# EAGLE board InkTime (EAGLE 9.7.0)
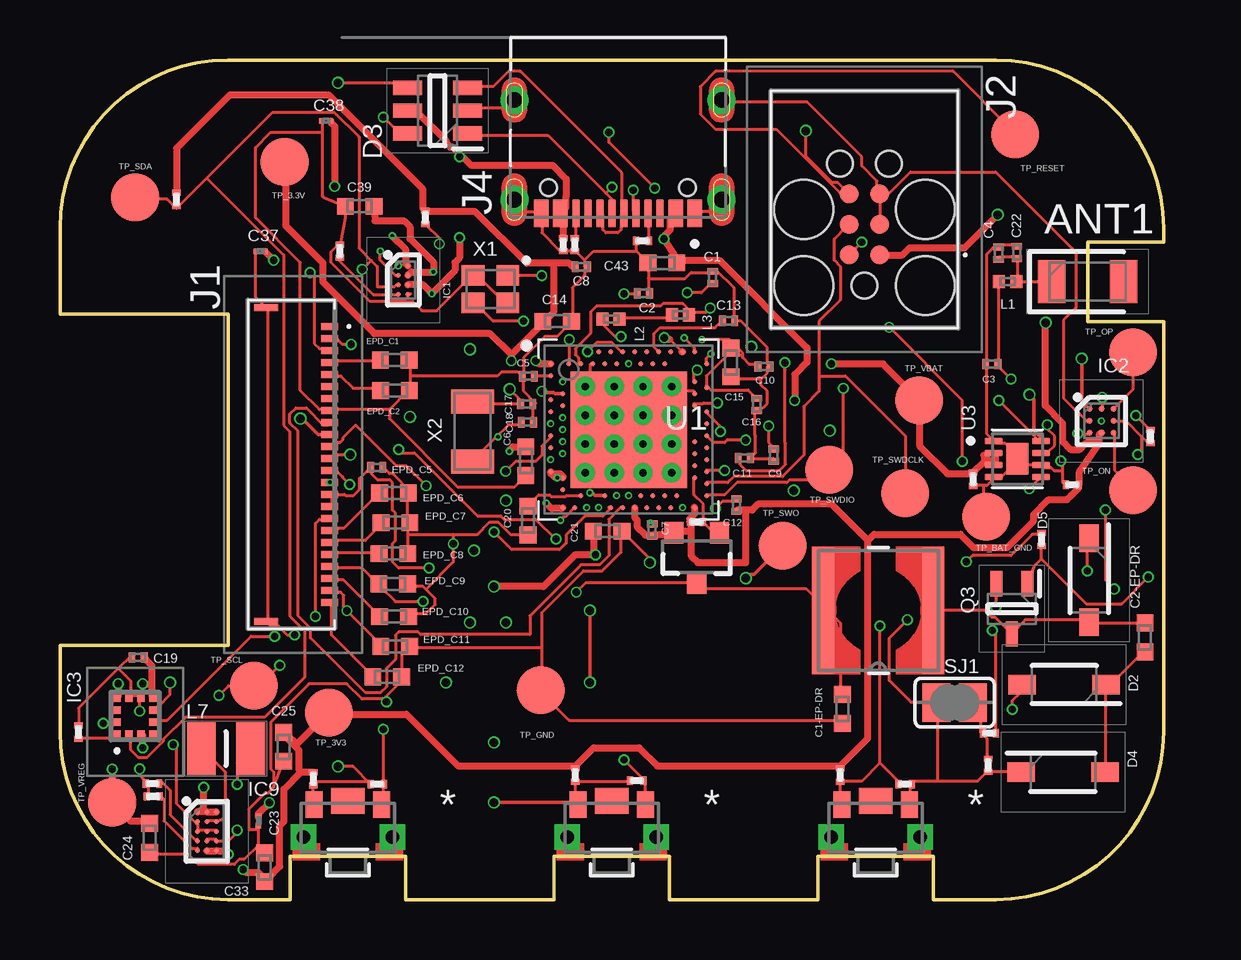
[diagram p2: board, top side]
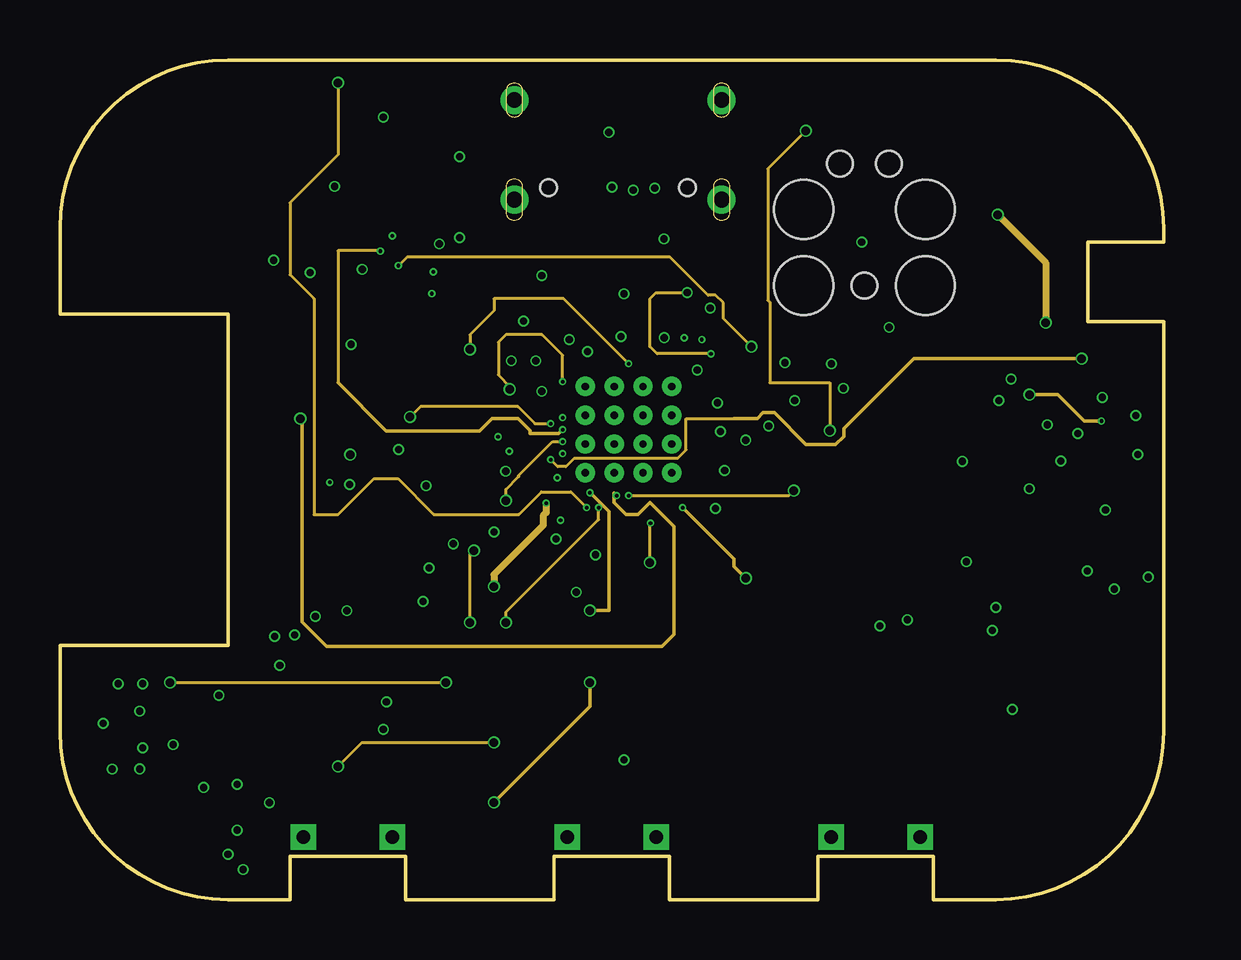
[diagram p3: board, inner layer Route2]
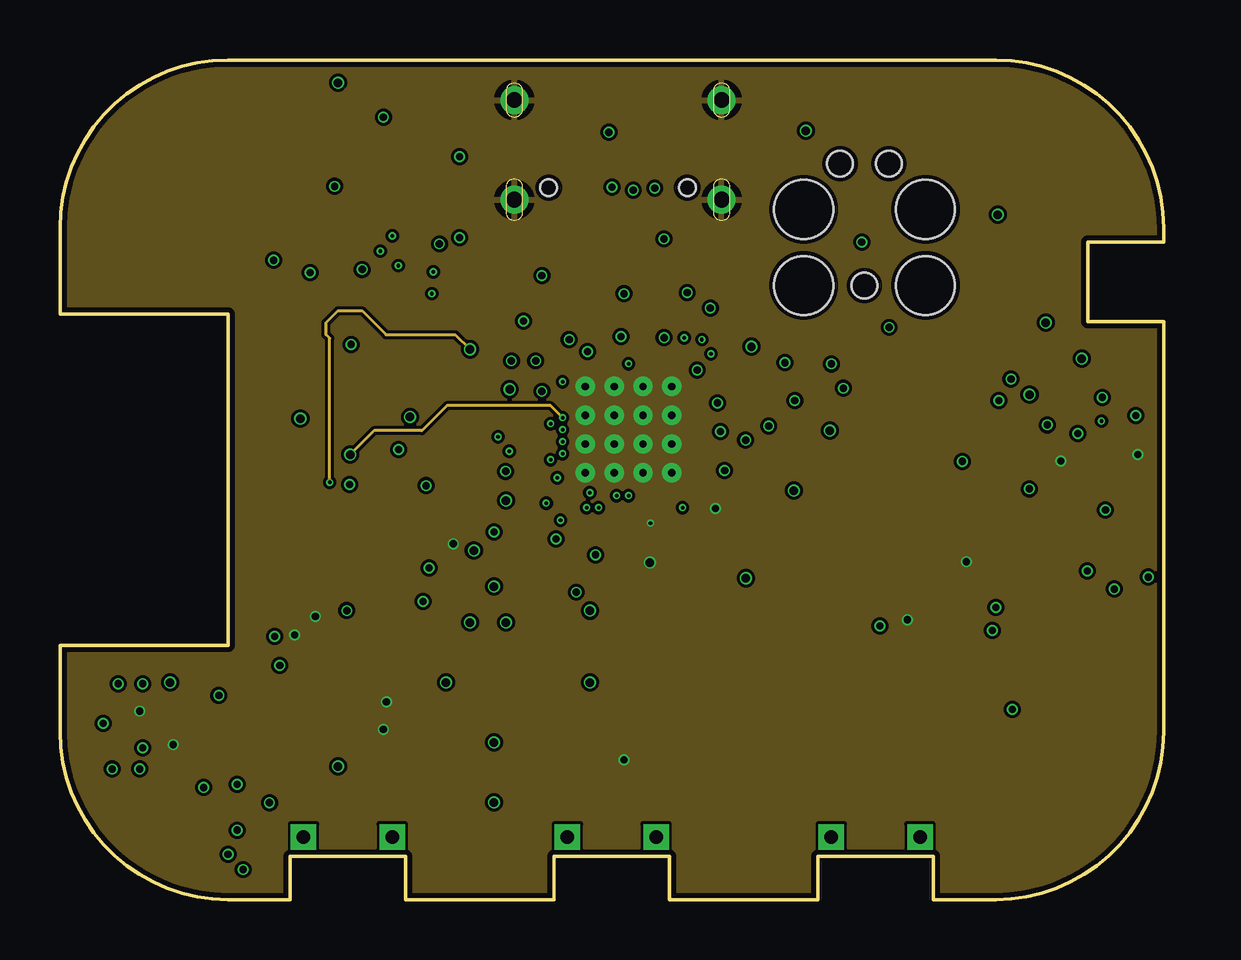
[diagram p4: board, inner layer Route15]
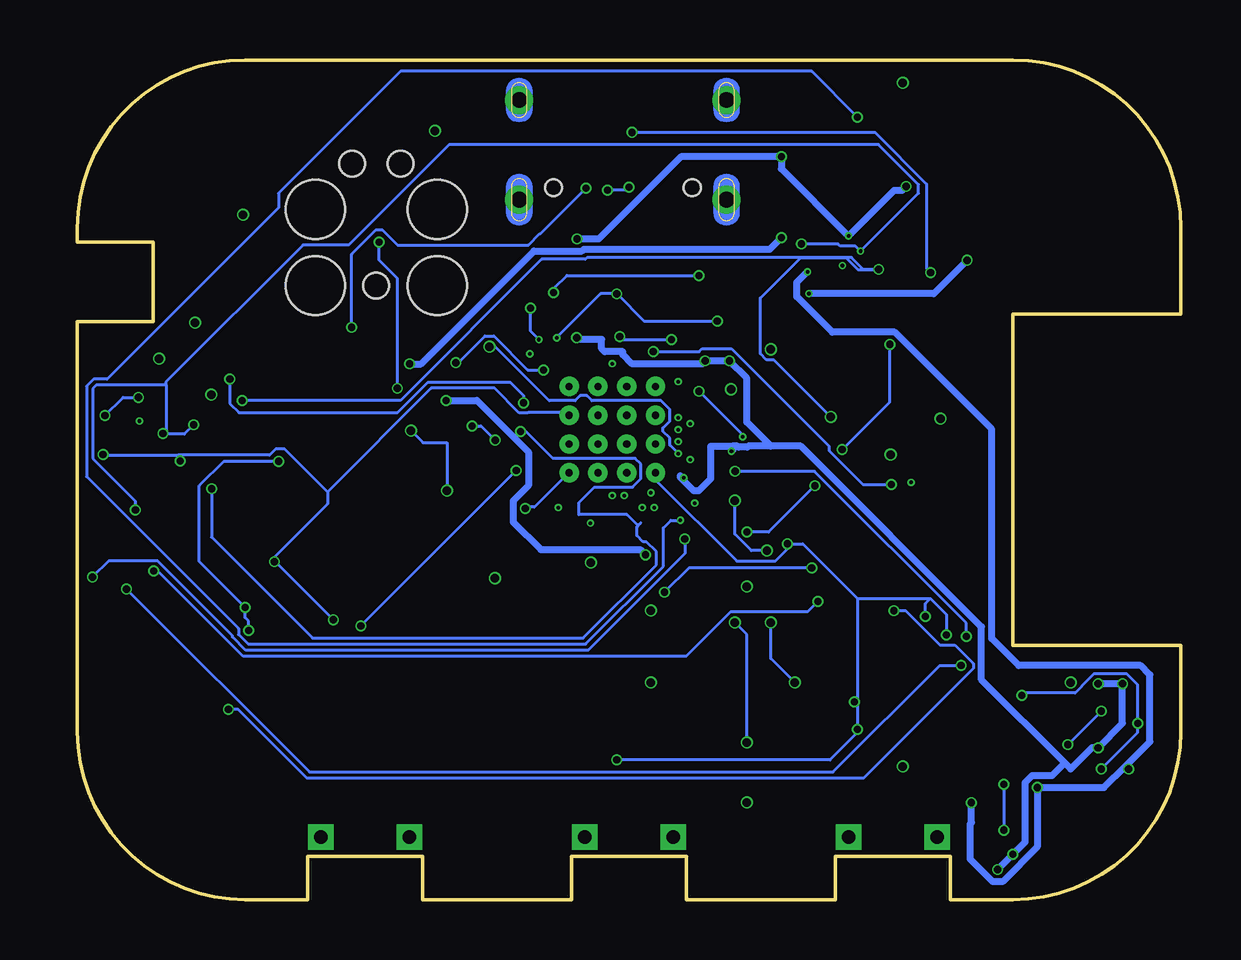
[diagram p5: board, bottom side, seen from below]

Size 46 x 35 mm. Coordinates in mm from the lower left corner, seen from the top.
Outline: 39,0 36.4,0 36.4,1.8 31.6,1.8 31.6,0 25.4,0 25.4,1.8 20.6,1.8 20.6,0 14.4,0 14.4,1.8 9.6,1.8 9.6,0 7,0 arc-90 0,7 0,10.6 7,10.6 7,24.4 0,24.4 0,28 arc-90 7,35 39,35 arc-90 46,28 46,27.42 42.84,27.42 42.84,24.09 46,24.09 46,7 arc-90 39,0
Copper layers (1+2*15+16): Top 0.035mm / dielectric 1.6mm / Route2 0.035mm / dielectric 0.15mm / Route15 0.035mm / dielectric 0.2mm / Bottom 0.035mm
Design rules "jlcpcb-2layers.dru *": minimum track width 5mil, minimum drill 0.3mm, track to track 5mil, track to pad 5mil, pad to pad 5mil, via to via 5mil, smd to smd 5mil, copper to edge 0.2mm, drill to drill 6mil, minimum pad ring 10mil, minimum via ring 3mil, stop-mask expansion 4mil, vias tented up to drill 0mil, thermal gap 10mil

## Footprints (pad centres in the part's own frame; a part is rotated, then mirrored left to right if it is on the bottom)
2450AT18B100E_ANTC3216X140N = smd 1.15 x 1.8: 1 -1.5,0; 2 1.5,0
NORDIC_NRF_3_RESC0201_L = smd 0.28 x 0.43: 1 -0.255,0; 2 0.255,0
NORDIC_NRF_3_RESC0402_M = smd 0.7 x 0.7: 1 -0.6,0; 2 0.6,0
GRM011R60J152KE01L_2_CAPC0201X13N = smd 0.22 x 0.23: 1 -0.185,0; 2 0.185,0
GRM011R60J152KE01L_1_0201 = smd 0.35 x 0.25: 1 0,0.275; 2 0,-0.275
ESP32_C6_LIBRARY_5_SOD3716X135N = smd 1.15 x 0.8: 1 -1.75,0; 2 1.75,0
ESP32_C6_LIBRARY_3_SOT95P280X145-6N = smd 1.2 x 0.6: 1 -1.25,0.95; 2 -1.25,0; 3 -1.25,-0.95; 4 1.25,-0.95; 5 1.25,0; 6 1.25,0.95
ESP32_C6_LIBRARY_4_ESP32_C6_LIBRARY_4_ESP32_C6_LIBRARY_4_ESP32_C6_LIBRARY_4_ESP32_WROVER_SPARKFUN-DISCRETESEMI_SOT23-3 = smd 0.8 x 0.9: 1 -0.95,-1; 2 0.95,-1; 3 0,1.1
BQ25180YBGR_BGA8C40P2X4_100X155X50 = smd 0.2 x 0.2: A1 -0.2,0.6; A2 0.2,0.6; B1 -0.2,0.2; B2 0.2,0.2; C1 -0.2,-0.2; C2 0.2,-0.2; D1 -0.2,-0.6; D2 0.2,-0.6
DRV2605YZFR_BGA9C50P3X3_144X144X62 = smd 0.25 x 0.25: A1 -0.5,0.5; A2 0,0.5; A3 0.5,0.5; B1 -0.5,0; B2 0,0; B3 0.5,0; C1 -0.5,-0.5; C2 0,-0.5; C3 0.5,-0.5
BMA423_BMA423 = smd 0.3 x 0.35: 1 -0.75,-0.775; 2 -0.25,-0.775; 3 0.25,-0.775; 4 0.75,-0.775; 7 0.75,0.775; 8 0.25,0.775; 9 -0.25,0.775; 10 -0.75,0.775 | smd 0.35 x 0.3: 5 0.775,-0.25; 6 0.775,0.25; 11 -0.775,0.25; 12 -0.775,-0.25
RT6160AWSC_BGA15C40P3X5_140X230X60 = smd 0.216 x 0.216: A1 -0.4,0.8; A2 0,0.8; A3 0.4,0.8; B1 -0.4,0.4; B2 0,0.4; B3 0.4,0.4; C1 -0.4,0; C2 0,0; C3 0.4,0; D1 -0.4,-0.4; D2 0,-0.4; D3 0.4,-0.4; E1 -0.4,-0.8; E2 0,-0.8; E3 0.4,-0.8
503480-2400_5034802400 = smd 0.3 x 0.7: 1 -5.75,1.525; 2 -5.25,1.525; 3 -4.75,1.525; 4 -4.25,1.525; 5 -3.75,1.525; 6 -3.25,1.525; 7 -2.75,1.525; 8 -2.25,1.525; 9 -1.75,1.525; 10 -1.25,1.525; 11 -0.75,1.525; 12 -0.25,1.525; 13 0.25,1.525; 14 0.75,1.525; 15 1.25,1.525; 16 1.75,1.525; 17 2.25,1.525; 18 2.75,1.525; 19 3.25,1.525; 20 3.75,1.525; 21 4.25,1.525; 22 4.75,1.525; 23 5.25,1.525; 24 5.75,1.525 | smd 0.3 x 1: MP1 -6.54,-1.125; MP2 6.54,-1.125
TC2030-IDC_TC2030IDC = smd 0.783 x 0.783: 1 -0.953,-0.635; 2 -0.953,0.635; 3 0.317,-0.635; 4 0.317,0.635; 5 1.588,-0.635; 6 1.588,0.635 | hole 2.451: -2.223,-2.54; -2.223,2.54; 0.952,-2.54; 0.952,2.54 | hole 1.067: -2.223,0; 2.857,-1.016; 2.857,1.016
KH-TYPE-C-16P_KINGHELM_KH-TYPE-C-16P = smd 0.6 x 1.15: A1_B12 -3.2,4.725; A4_B9 -2.4,4.725; A9_B4 2.4,4.725; A12_B1 3.2,4.725 | smd 0.3 x 1.15: A5 -1.25,4.725; A6 -0.25,4.725; A7 0.25,4.725; A8 1.25,4.725; B5 1.75,4.725; B6 0.75,4.725; B7 -0.75,4.725; B8 -1.75,4.725 | drill 0.65 pad 1.05: SH1 -4.32,0; SH2 4.32,0; SH3 -4.32,4.15; SH4 4.32,4.15 | hole 0.7: -2.89,3.65; 2.89,3.65
NORDIC_NRF_2_RESC0201_M = smd 0.5 x 0.55: 1 -0.355,0; 2 0.355,0
ESP32_C6_LIBRARY_2_IND_4828-WE-TPC_WRE = smd 0.9 x 5.3: 1 -2.286,0; 2 2.286,0
MLP2016SR47MT0S1_INDC2016X100N = smd 1.2 x 2.2: 1 -1.028,0; 2 1.028,0
ESP32_C6_LIBRARY_6_SOT65P210X110-3N = smd 1.05 x 0.5: 1 -1.05,0.65; 2 -1.05,-0.65; 3 1.05,0
ERA-1AEB3401C_0201 = smd 0.35 x 0.25: 1 0,0.275; 2 0,-0.275
ESP32_C6_LIBRARY_7_JUMPER_SJ = smd 1.168 x 1.6: 1 -0.762,0; 2 0.762,0
2025-10-22_07-23-44_LIBRARY_SW_EVP-AKE31A_PAN = smd 0.711 x 1.092: 1 -1.4,-0.972; 2 1.4,-0.972 | drill 0.559 pad 0.914 square: 3 -1.848,0.381; 4 1.848,0.381 | smd 1.397 x 1.092: 5 0,-1.124
HECTOR_WATCH_1_TP20R = smd 2 x 2: TP 0,0
NORDIC_NRF_4_AQFN50P700X700X85_HS-74N = smd 4.85 x 4.85: P$74 0,0 | drill 0.3 pad 0.6: P$75 -1.8,1.8; P$76 -0.6,1.8; P$77 0.6,1.8; P$78 1.8,1.8; P$79 -1.8,0.6; P$80 -0.6,0.6; P$81 0.6,0.6; P$82 1.8,0.6; P$83 -1.8,-0.6; P$84 -0.6,-0.6; P$85 0.6,-0.6; P$86 1.8,-0.6; P$87 -1.8,-1.8; P$88 -0.6,-1.8; P$89 0.6,-1.8; P$90 1.8,-1.8 | smd 0.2 x 0.2: P$A8 -1.25,3.25; P$A10 -0.75,3.25; P$A12 -0.25,3.25; P$A14 0.25,3.25; P$A16 0.75,3.25; P$A18 1.25,3.25; P$A20 1.75,3.25; P$A22 2.25,3.25; P$A23 2.75,3.25; P$AA24 3.25,-2.25; P$AB2 -2.75,-2.5; P$AC5 -2,-2.75; P$AC9 -1,-2.75; P$AC11 -0.5,-2.75; P$AC13 0,-2.75; P$AC15 0.5,-2.75; P$AC17 1,-2.75; P$AC19 1.5,-2.75; P$AC21 2,-2.75; P$AC24 3.25,-2.75; P$AD2 -2.75,-3.25; P$AD4 -2.25,-3.25; P$AD6 -1.75,-3.25; P$AD8 -1.25,-3.25; P$AD10 -0.75,-3.25; P$AD12 -0.25,-3.25; P$AD14 0.25,-3.25; P$AD16 0.75,-3.25; P$AD18 1.25,-3.25; P$AD20 1.75,-3.25; P$AD22 2.25,-3.25; P$AD23 2.75,-3.25; P$B1 -3.25,2.75; P$B3 -2.5,2.75; P$B5 -2,2.75; P$B7 -1.5,2.75; P$B9 -1,2.75; P$B11 -0.5,2.75; P$B13 0,2.75; P$B15 0.5,2.75; P$B17 1,2.75; P$B19 1.5,2.75; P$B24 3.25,2.75; P$C1 -3.25,2.25; P$D2 -2.75,2; P$D23 2.75,2; P$E24 3.25,1.75; P$F2 -2.75,1.5; P$F23 2.75,1.5; P$G1 -3.25,1.25; P$H2 -2.75,1; P$H23 2.75,1; P$J1 -3.25,0.75; P$J24 3.25,0.75; P$K2 -2.75,0.5; P$L1 -3.25,0.25; P$L24 3.25,0.25; P$M2 -2.75,0; P$N1 -3.25,-0.25; P$N24 3.25,-0.25; P$P2 -2.75,-0.5; P$P23 2.75,-0.5; P$R1 -3.25,-0.75; P$R24 3.25,-0.75; P$T2 -2.75,-1; P$T23 2.75,-1; P$U1 -3.25,-1.25; P$U24 3.25,-1.25; P$V23 2.75,-1.5; P$W1 -3.25,-1.75; P$W24 3.25,-1.75; P$Y2 -2.75,-2; P$Y23 2.75,-2
ESP32_C6_LIBRARY_SON50P200X200X80-9N = smd 0.76 x 0.27: 1 -0.985,0.75; 2 -0.985,0.25; 3 -0.985,-0.25; 4 -0.985,-0.75; 5 0.985,-0.75; 6 0.985,-0.25; 7 0.985,0.25; 8 0.985,0.75 | smd 0.9 x 1.3: 9 0,0
NORDIC_NRF_BT-XTAL_2016_N = smd 0.95 x 0.85: 1 -0.725,-0.575; 2 0.725,-0.575; 3 0.725,0.575; 4 -0.725,0.575
NORDIC_NRF_1_XTAL_3215_N = smd 1 x 1.8: 1 -1.25,0; 2 1.25,0

## Placement (x,y rotation side)
ANT1  2450AT18B100E  [2450AT18B100E_ANTC3216X140N]  42.83,25.76 0 top
C1  12pF  [NORDIC_NRF_3_RESC0201_L]  27.2,25.93 90 top
C1-EP-DR  10uF  [NORDIC_NRF_3_RESC0402_M]  32.62,7.95 270 top
C2  12pF  [NORDIC_NRF_3_RESC0201_L]  24.32,25.27 0 top
C2-EP-DR  4.7uF/25V  [NORDIC_NRF_3_RESC0402_M]  45.23,10.93 90 top
C3  1pF  [NORDIC_NRF_3_RESC0201_L]  38.84,22.32 180 top
C4  1pF  [NORDIC_NRF_3_RESC0201_L]  39.12,26.95 90 top
C5  100nF  [NORDIC_NRF_3_RESC0201_L]  19.52,21.82 180 top
C6  4.7uF  [NORDIC_NRF_3_RESC0402_M]  19.42,18.27 270 top
C7  100nF  [NORDIC_NRF_3_RESC0201_L]  24.68,15.4 90 top
C8  100nF  [NORDIC_NRF_3_RESC0201_L]  21.73,26.38 0 top
C9  820pF  [NORDIC_NRF_3_RESC0201_L]  29.75,18.53 270 top
C10  N.C  [NORDIC_NRF_3_RESC0201_L]  29.35,22.22 0 top
C11  100pF  [NORDIC_NRF_3_RESC0201_L]  28.53,18.41 0 top
C12  100nF  [NORDIC_NRF_3_RESC0201_L]  28.2,16.44 90 top
C13  N.C.  [NORDIC_NRF_3_RESC0201_L]  27.86,24.12 0 top
C14  4.7uF  [NORDIC_NRF_3_RESC0402_M]  20.72,24.11 0 top
C15  1.0uF  [NORDIC_NRF_3_RESC0402_M]  27.97,22.39 270 top
C16  47nF  [NORDIC_NRF_3_RESC0201_L]  29.04,20.64 270 top
C17  12pF  [NORDIC_NRF_3_RESC0201_L]  19.45,20.66 180 top
C18  12pF  [NORDIC_NRF_3_RESC0201_L]  19.49,19.9 180 top
C19  100nF  [NORDIC_NRF_3_RESC0201_L]  3.25,10.09 180 top
C20  4.7uF  [NORDIC_NRF_3_RESC0402_M]  19.51,15.8 270 top
C21  4.7uF  [NORDIC_NRF_3_RESC0402_M]  22.83,15.36 0 top
C22  N.C  [NORDIC_NRF_3_RESC0201_L]  39.88,26.98 90 top
C23  0.1uF  [GRM011R60J152KE01L_2_CAPC0201X13N]  8.28,3.27 90 top
C24  10uF  [NORDIC_NRF_3_RESC0402_M]  3.74,2.57 90 top
C25  22uF  [NORDIC_NRF_3_RESC0402_M]  9.33,6.37 270 top
C27  0.1uF  [GRM011R60J152KE01L_1_0201]  38.06,17.52 180 top
C29  1uF  [GRM011R60J152KE01L_1_0201]  35.23,4.81 270 top
C30  1uF  [GRM011R60J152KE01L_1_0201]  13.23,4.81 270 top
C31  1uF  [GRM011R60J152KE01L_1_0201]  24.04,4.96 270 top
C32  1uF  [GRM011R60J152KE01L_1_0201]  45.45,19.3 180 top
C33  22uF  [NORDIC_NRF_3_RESC0402_M]  8.54,1.35 90 top
C34  01.uF  [GRM011R60J152KE01L_1_0201]  42.2,17.3 90 top
C37  1uF  [GRM011R60J152KE01L_2_CAPC0201X13N]  8.36,27.02 0 top
C38  1uF  [GRM011R60J152KE01L_2_CAPC0201X13N]  11.1,32.45 0 top
C39  10uF  [NORDIC_NRF_3_RESC0402_M]  12.49,28.9 180 top
C42  0.1uF  [GRM011R60J152KE01L_1_0201]  20.98,27.3 0 top
C43  4.7uF  [NORDIC_NRF_3_RESC0402_M]  25.11,26.54 180 top
D2  MBR0530  [ESP32_C6_LIBRARY_5_SOD3716X135N]  41.86,8.96 180 top
D3  USBLC6-2SC6Y  [ESP32_C6_LIBRARY_3_SOT95P280X145-6N]  15.74,32.89 180 top
D4  MBR0530  [ESP32_C6_LIBRARY_5_SOD3716X135N]  41.81,5.31 0 top
D5  MBR0530  [ESP32_C6_LIBRARY_5_SOD3716X135N]  42.9,13.31 270 top
DMG2305UX-7  20V/4.2A/52mΩ/1.4W  [ESP32_C6_LIBRARY_4_ESP32_C6_LIBRARY_4_ESP32_C6_LIBRARY_4_ESP32_C6_LIBRARY_4_ESP32_WROVER_SPARKFUN-DISCRETESEMI_SOT23-3]  26.54,14.29 180 top
EPD_C1  1uF/50V  [NORDIC_NRF_3_RESC0402_M]  13.96,21.21 180 top
EPD_C2  1uF/50V  [NORDIC_NRF_3_RESC0402_M]  13.95,22.48 180 top
EPD_C5  0.1uF/50V  [NORDIC_NRF_3_RESC0201_L]  13.21,18.02 180 top
EPD_C6  1uF/50V  [NORDIC_NRF_3_RESC0402_M]  13.92,16.95 180 top
EPD_C7  1uF/50V  [NORDIC_NRF_3_RESC0402_M]  13.98,15.71 180 top
EPD_C8  1uF/50V  [NORDIC_NRF_3_RESC0402_M]  13.9,14.42 180 top
EPD_C9  1uF/50V  [NORDIC_NRF_3_RESC0402_M]  13.89,13.16 180 top
EPD_C10  1uF/50V  [NORDIC_NRF_3_RESC0402_M]  13.93,11.79 180 top
EPD_C11  1uF/50V  [NORDIC_NRF_3_RESC0402_M]  13.97,10.55 180 top
EPD_C12  1uF/50V  [NORDIC_NRF_3_RESC0402_M]  13.64,9.28 180 top
IC1  BQ25180YBGR  [BQ25180YBGR_BGA8C40P2X4_100X155X50]  14.31,25.83 0 top
IC2  DRV2605YZFR  [DRV2605YZFR_BGA9C50P3X3_144X144X62]  43.41,19.95 0 top
IC3  BMA421  [BMA423_BMA423]  3.13,7.65 0 top
IC9  RT6160AWSC  [RT6160AWSC_BGA15C40P3X5_140X230X60]  6.12,2.84 0 top
J1  503480-2400  [503480-2400_5034802400]  9.72,18.14 270 top
J2  TC2030-IDC  [TC2030-IDC_TC2030IDC]  33.54,27.82 90 top
J4  KH-TYPE-C-16P  [KH-TYPE-C-16P_KINGHELM_KH-TYPE-C-16P]  23.26,33.33 180 top
L1  3.9nH  [NORDIC_NRF_2_RESC0201_M]  39.5,25.76 0 top
L2  10uH  [NORDIC_NRF_2_RESC0201_M]  22.98,24.2 0 top
L3  15nH  [NORDIC_NRF_2_RESC0201_M]  25.86,24.37 0 top
L5  68uH  [ESP32_C6_LIBRARY_2_IND_4828-WE-TPC_WRE]  34.11,12.05 180 top
L7  FTC252012SR47MBCA  [MLP2016SR47MT0S1_INDC2016X100N]  6.92,6.29 0 top
Q3  SI1308EDL-T1-GE3  [ESP32_C6_LIBRARY_6_SOT65P210X110-3N]  39.68,12.12 270 top
R1_EP_DR  0.47  [ERA-1AEB3401C_0201]  38.74,6.93 90 top
R1_USB  5K1  [ERA-1AEB3401C_0201]  24.28,27.46 90 top
R2  0  [ERA-1AEB3401C_0201]  3.89,4.3 90 top
R2_EP_DR  10K  [ERA-1AEB3401C_0201]  40.92,15.01 0 top
R2_USB  5K1  [ERA-1AEB3401C_0201]  21.45,27.3 0 top
R3  0  [ERA-1AEB3401C_0201]  0.77,6.98 0 top
R4  0  [ERA-1AEB3401C_0201]  3.86,4.83 90 top
R5  10k  [ERA-1AEB3401C_0201]  10.56,5.04 180 top
R7  10k  [ERA-1AEB3401C_0201]  32.52,5.19 180 top
R8  10k  [ERA-1AEB3401C_0201]  21.48,5.19 180 top
R9  10K  [ERA-1AEB3401C_0201]  11.67,27.03 0 top
R17  3K3  [ERA-1AEB3401C_0201]  15.23,28.44 0 top
R18  3K3  [ERA-1AEB3401C_0201]  4.86,29.19 0 top
R_PWR_EPD  10K  [ERA-1AEB3401C_0201]  26.53,15.74 270 top
R_TYPE_SEL  10K  [ERA-1AEB3401C_0201]  38.69,5.59 180 top
SJ1  [ESP32_C6_LIBRARY_7_JUMPER_SJ]  37.3,8.21 0 top
SW_DN  2025-10-22_07-23-44_LIBRARY_EVP-AKE31ASW_EVP-AKE31A_PAN  [2025-10-22_07-23-44_LIBRARY_SW_EVP-AKE31A_PAN]  34,2.99 180 top
SW_ENT  2025-10-22_07-23-44_LIBRARY_EVP-AKE31ASW_EVP-AKE31A_PAN  [2025-10-22_07-23-44_LIBRARY_SW_EVP-AKE31A_PAN]  23,2.99 180 top
SW_UP  2025-10-22_07-23-44_LIBRARY_EVP-AKE31ASW_EVP-AKE31A_PAN  [2025-10-22_07-23-44_LIBRARY_SW_EVP-AKE31A_PAN]  12,2.99 180 top
TP_3.3V  HECTOR_WATCH_1_TPTP20R  [HECTOR_WATCH_1_TP20R]  9.37,30.76 0 top
TP_3V3  HECTOR_WATCH_1_TPTP20R  [HECTOR_WATCH_1_TP20R]  11.21,7.8 0 top
TP_BAT_GND  HECTOR_WATCH_1_TPTP20R  [HECTOR_WATCH_1_TP20R]  38.61,15.95 0 top
TP_GND  HECTOR_WATCH_1_TPTP20R  [HECTOR_WATCH_1_TP20R]  20.04,8.73 0 top
TP_ON  HECTOR_WATCH_1_TPTP20R  [HECTOR_WATCH_1_TP20R]  44.72,17.07 0 top
TP_OP  HECTOR_WATCH_1_TPTP20R  [HECTOR_WATCH_1_TP20R]  44.72,22.82 0 top
TP_RESET  HECTOR_WATCH_1_TPTP20R  [HECTOR_WATCH_1_TP20R]  39.82,31.9 0 top
TP_SCL  HECTOR_WATCH_1_TPTP20R  [HECTOR_WATCH_1_TP20R]  8.09,8.91 0 top
TP_SDA  HECTOR_WATCH_1_TPTP20R  [HECTOR_WATCH_1_TP20R]  3.13,29.27 0 top
TP_SWDCLK  HECTOR_WATCH_1_TPTP20R  [HECTOR_WATCH_1_TP20R]  35.23,16.94 0 top
TP_SWDIO  HECTOR_WATCH_1_TPTP20R  [HECTOR_WATCH_1_TP20R]  32.05,17.92 0 top
TP_SWO  HECTOR_WATCH_1_TPTP20R  [HECTOR_WATCH_1_TP20R]  30.12,14.75 0 top
TP_VBAT  HECTOR_WATCH_1_TPTP20R  [HECTOR_WATCH_1_TP20R]  35.82,20.81 0 top
TP_VREG  HECTOR_WATCH_1_TPTP20R  [HECTOR_WATCH_1_TP20R]  2.18,4.05 0 top
U1  NRF52840_QF  [NORDIC_NRF_4_AQFN50P700X700X85_HS-74N]  23.7,19.59 0 top
U3  MAX17048G+T10  [ESP32_C6_LIBRARY_SON50P200X200X80-9N]  39.91,18.37 0 top
X1  32MHz  [NORDIC_NRF_BT-XTAL_2016_N]  17.94,25.45 180 top
X2  32.768kHz  [NORDIC_NRF_1_XTAL_3215_N]  17.2,19.52 270 top

## Tracks (layer width: path | path; a pad name or v marks a point on that pad's centre or on a via)
3V3  (via drill 0.15, 0.3, 0.35)
  Top 0.127: 25.93,22.84 25.42,23.35
  Top 0.3: 20.59,26.52 21.23,26.52 21.36,26.39 C8.1 | 20.47,17.76 20.85,17.76 20.97,17.63 U1.P$Y2 | v19.83,22.46 19.96,22.33 20.47,22.33 U1.P$B1 | 18.82,22.71 v18.82,22.46 | 18.82,22.71 20.09,23.98 C14.1 20.21,24.11 20.59,24.49 20.59,26.52 | 20.47,17.76 U1.P$W1 | 18.82,22.71 17.93,23.59 13.11,23.59 10.96,25.74 10.96,26.54 9.42,28.08 9.42,30.71 TP_3.3V.TP | 43.33,19.03 43.33,19.41 IC2.C2 | 43.33,19.03 42.47,17.8 C34.2 42.44,17.26 42.44,17.12 42.16,16.85 42.15,16.85 41.97,16.67 41.21,16.67 40.59,16.05 40.59,15.79 39.48,14.68 38.08,14.68 37.54,15.22 33.93,15.22 33.67,14.96 | 34.18,26.9 J2.1 35.12,26.87 35.42,27.17 37.71,27.17 v39.09,28.55 | 3.83,9 3.83,9.76 3.58,10.01 C19.1 | 3.83,9 3.83,8.49 IC3.7 | IC9.E2 6.12,2.01 6.5,2.01 IC9.E3 6.62,2.01 6.88,2.01 v7,1.88 | v3.45,6.33 3.45,6.84 IC3.3 | v2.43,9 2.43,8.49 IC3.10 | v3.45,9 3.83,9 | 26.43,16.36 U1.P$AD23 26.45,16.08 26.25,15.88 R_PWR_EPD.2 26.31,15.73 26.31,15.35 | 26.31,15.35 25.67,15.35 DMG2305UX-7.2 25.55,15.22 24.78,15.22 C7.1 24.64,15.19 24.4,15.19 24.06,15.53 24.06,15.82 23.95,15.93 U1.P$AD14 | 10.05,5.31 R5.2 | 28.59,16.23 28.85,16.23 29.1,16.49 32.15,16.49 33.67,14.96 | 28.59,16.23 28.21,16.23 C12.1 | 33.67,14.96 33.67,6.71 32.53,5.57 R7.2 32.4,5.57 24.9,5.57 24.14,6.33 22.24,6.33 21.48,5.57 R8.2 21.36,5.57 16.6,5.57 14.44,7.73 11.32,7.73 TP_3V3.TP 9.89,6.48 C25.1 9.33,6.86 9.95,6.23 9.95,5.41 10.05,5.31 | C6.1 18.88,18.87 18.73,18.72 v18.73,18.69 | 20.47,17.76 20.63,17.6 20.71,17.6 v20.73,17.58 | 43.33,19.03 42.76,19.03 42.48,18.75 42.14,18.75 41.8,19.08 41.8,19.85 41.07,20.59 41.07,24.03 v41.09,24.05
  Top 0.3: 25.42,23.35 25.26,23.35 v25.18,23.42 | U1.P$A22 25.93,22.84 | 10.05,5.31 9.34,4.6 9.34,3.26 9.16,3.08 9.16,1.38 8.65,0.87 C33.1 8.53,0.87 8.27,1.12 7.77,1.12 v7.64,1.25 | R18.1 4.86,31.32 7.09,33.55 11.19,33.55 15.13,29.61 15.13,28.81 R17.1 15.26,28.68 17.3,28.68 19.46,26.52 20.59,26.52 | 26.31,15.35 26.31,14.33 26.59,14.05 28.59,14.05 28.59,16.23
  Route2 0.3: v39.09,28.55 41.09,26.55 v41.09,24.05
  Bottom 0.3: 18.69,18.9 19.59,18.9 19.59,17.55 20.09,17.05 20.31,17.05 20.84,17.58 | v3.45,9 v2.43,9 2.43,7.34 v3.45,6.33 3.71,6.33 4.6,5.44 4.85,5.69 | 18.69,18.9 18.66,18.87 18.66,18.76 v18.73,18.69 | v25.18,23.42 25.11,23.35 24.15,23.35 24.15,22.97 24.02,22.84 23.26,22.84 23.26,22.71 22.88,22.33 19.96,22.33 v19.83,22.46 v18.82,22.46 18.09,21.73 18.09,19.9 17.09,18.9 | 20.86,17.66 20.86,17.6 20.84,17.58 | 17.09,18.9 15.84,18.9 8.31,11.38 8.31,9.16 4.85,5.69 | 4.85,5.69 5.37,5.17 6.2,5.17 6.49,4.88 6.49,2.4 v7,1.88 v7.64,1.25 | 17.09,18.9 18.04,18.9 18.08,18.86 18.44,18.86 18.48,18.9 18.69,18.9 | 20.84,17.58 v20.73,17.58
ALERT  (via drill 0.3)
  Top 0.127: v40.41,17.12 40.79,17.5 U3.5 | U1.P$J24 26.95,20.29 27.53,19.71 v27.53,19.51
  Bottom 0.127: v40.41,17.12 40.41,15.11 36.2,10.9 24.92,10.9 21.86,13.96 21.86,14.5 22.28,14.91 22.41,14.91 22.67,15.17 22.67,15.54 22.63,15.59 | 22.63,15.59 22.51,15.71 | 22.63,15.59 23.09,16.05 25.09,16.05 25.09,16.55 24.45,17.2 22.85,17.2 22.51,17.54 22.51,18.15 22.75,18.39 26.18,18.39 27.29,19.51 v27.53,19.51
D+  (via drill 0.15, 0.35)
  Top 0.127: v11.59,34.05 14.27,34.05 D3.4
  Route2 0.127: v11.59,34.05 11.59,31.05 9.59,29.05 9.59,26.05 10.59,25.05 10.59,16.05 11.59,16.05 13.09,17.55 14.09,17.55 15.58,16.06 19.14,16.06 20.07,17 21.29,17 U1.P$AD6
  other vias: 21.95,16.34
D-  (via drill 0.15, 0.3)
  Top 0.127: v13.48,32.62 14.12,31.98 14.37,31.98 D3.6 | U1.P$AD4 21.06,15.95 20.98,15.95 20.86,15.83 v20.86,15.81
  Bottom 0.127: v13.48,32.62 15.39,34.52 32.53,34.52 37.61,29.44 37.61,28.84 44.76,21.7 45.32,21.7 45.61,21.4 45.61,17.63 39.28,11.29 39.28,11.05 38.88,10.65 24.81,10.65 21.57,13.89 21.57,15.5 21.26,15.81 v20.86,15.81
DN  (via drill 0.3)
  Top 0.127: 22.75,29.44 20.34,31.86 17.04,31.86 D3.1 | 22.75,29.44 23.01,29.19 23.01,28.68 J4.A7 | v23.89,29.57 23.89,28.68 J4.B7 | 22.75,29.44 v23.01,29.7
  Bottom 0.127: v23.01,29.7 23.14,29.57 v23.89,29.57
DP
  Top 0.127: J4.B6 22.62,28.55 22.62,27.92 22.75,27.79 23.26,27.79 23.39,27.92 23.39,28.55 J4.A6 23.42,28.69 23.42,30.29 19.2,34.52 18.69,34.52 18.05,33.89 17.04,33.89 D3.3
EPD_3V3  (via drill 0.3)
  Top 0.127: J1.16 11.32,16.49 11.32,16.87 J1.15 11.86,16.89 11.9,16.85 12.24,16.85 12.49,17.09 12.49,17.55 EPD_C5.2 12.97,18.01 12.97,17.76 13.23,17.5 13.73,17.5 13.86,17.38 13.86,16.23 13.99,16.11 13.99,14.96 13.86,14.84 13.86,14.08 14.12,13.82 v15.39,13.82 | C1-EP-DR.1 32.53,8.61 32.53,11.54 32.31,11.76 L5.2 31.79,12.28 31.11,12.95 26.78,12.95 DMG2305UX-7.3 21.9,13.19 v21.52,12.81
  Bottom 0.127: v15.39,13.82 20.51,13.82 v21.52,12.81
EPD_BUSY
  Top 0.127: U1.P$AD12 23.39,16.36 22.88,15.85 22.88,14.34 22.5,13.96 21.71,13.96 19.59,11.83 19.59,11.05 15.04,11.05 14.93,11.16 14.12,11.16 13.99,11.03 13.99,10.01 13.61,9.63 13.61,8.87 13.35,8.61 12.73,8.61 10.45,10.9 10.45,11.31 9.93,11.83 9.93,19.52 9.58,19.87 9.58,20.23 9.84,20.49 10.27,20.49 10.97,19.79 11.2,19.79 J1.9
EPD_CS  (via drill 0.15, 0.35)
  Top 0.127: J1.12 11.4,18.55 11.67,18.55 v12.1,18.55
  Route15 0.127: U1.P$K2 20.45,20.59 16.13,20.59 15.09,19.55 13.09,19.55 v12.1,18.56 v12.1,18.55
  other vias: 20.95,20.09
EPD_DC  (via drill 0.3)
  Top 0.127: U1.P$AD10 22.88,16.36 22.88,16.23 22.62,15.98 21.89,15.98 21.1,15.19 21.1,14.86 20.82,14.58 18.82,14.58 v18.09,15.32 | v15.26,17.25 14.43,18.08 14.03,18.08 12.33,19.78 11.78,19.23 11.78,19.16 11.67,19.05 11.4,19.05 J1.11
  Bottom 0.127: v15.26,17.25 17.19,15.32 v18.09,15.32
EPD_RST  (via drill 0.15, 0.35)
  Top 0.152: J1.10 10.75,19.39 10.09,20.05 v10.02,20.05
  Route2 0.152: U1.P$AC11 23.09,16.95 23.09,16.55 23.59,16.05 24.09,16.05 24.59,16.55 25.59,15.55 25.59,11.05 25.09,10.55 11.12,10.55 10.09,11.58 10.09,19.98 v10.02,20.05
  other vias: 23.2,16.84
GDR  (via drill 0.3)
  Top 0.127: 40.91,14.2 40.91,14.71 R2_EP_DR.2 | 40.91,14.2 40.6,13.89 Q3.1 | J1.2 11.32,23.35 11.58,23.35 11.78,23.14 v12.13,23.14 | v20.68,15.03 20.65,15.03 19.82,15.85 18.5,15.85 18.37,15.99 17.41,15.99 14.77,18.62 14.25,18.62 v14.12,18.75 | 40.91,14.2 42.79,12.32 44.25,12.32 v45.37,13.44
  Bottom 0.127: v12.13,23.14 12.13,20.74 v14.12,18.75 | v20.68,15.03 20.68,14.42 24.71,10.39 38.98,10.39 39.53,10.94 39.53,11 42.64,14.11 44.7,14.11 v45.37,13.44
GND  (via drill 0.15, 0.3, 0.35)
  Top 0.127: 2.94,8.49 3.32,8.49 IC3.8 3.32,8.36 v3.32,7.85 | 2.43,9.63 2.94,10.14 C19.2 | 2.43,9.63 0.78,7.98 0.78,7.34 R3.1 | 2.94,8.49 2.94,9.12 2.43,9.63 | 2.94,8.49 IC3.9 | 5.73,3.15 5.73,2.9 | 5.73,2.9 6.12,2.9 | 5.73,2.9 IC9.C1 | 6.12,2.9 6.5,2.9 IC9.C3 | 6.12,2.9 IC9.C2 | 8.27,2.26 8.27,2.9 | 8.27,2.9 8.27,3.03 C23.1 | 8.27,2.26 8.53,2.01 C33.2 8.27,2.26 | 8.27,2.9 7.89,2.9 7.89,3.79 8.56,4.45 8.69,4.45 8.88,4.65 | C24.1 3.83,1.88 5.35,1.88 5.77,1.47 7.27,1.47 7.46,1.67 7.68,1.67 8.27,2.26 | 8.88,4.65 8.91,4.68 8.91,5.31 8.78,5.44 8.78,7.39 10.38,9 11.96,9 12.59,8.36 13.48,8.36 | 8.88,4.65 C25.2 | 5.73,3.15 IC9.B1 | C1-EP-DR.2 32.53,7.47 21.23,7.47 20.09,8.61 TP_GND.TP 20.09,8.74 20.09,10.52 | 20.09,10.52 14.62,10.52 EPD_C11.1 14.5,10.52 14.24,10.27 14.24,9.38 EPD_C12.1 14.12,9.25 14.12,9 13.48,8.36 | 10.94,31.98 10.94,29.32 10.97,29.28 C39.2 11.89,28.4 11.7,27.41 R9.1 11.58,27.28 11.3,27.01 11.3,26.55 12.92,24.94 14.31,24.94 | 10.94,31.98 10.94,32.36 C38.1 | IC1.D2 14.5,25.25 14.62,25.25 14.31,24.94 | X1.4 18.56,24.87 17.29,26.14 X1.2 17.16,26.01 15.7,24.55 15.09,24.55 14.7,24.94 14.31,24.94 | 13.73,20.43 11.32,20.43 J1.8 11.2,20.43 10.81,20.43 10.02,21.23 10.02,26.56 8.15,28.43 8.15,31.35 8.78,31.98 10.94,31.98 | 13.73,20.43 14.5,21.19 EPD_C1.1 14.62,21.32 14.62,21.82 | 13.73,20.43 13.73,20.05 16.58,17.2 18.95,17.2 C6.2 | 14.62,21.82 14.62,22.46 EPD_C2.1 | 29.23,21.7 29.48,21.95 29.48,22.2 C10.2 29.48,22.33 29.48,23.02 28.38,24.12 C13.2 28.09,24.24 28.09,25.51 27.32,26.27 C1.2 27.2,26.14 26.31,26.14 26.05,25.89 24.53,25.89 | 29.23,21.7 28.09,21.7 C15.2 | C9.2 29.74,18.39 28.85,18.39 C11.2 29,18.62 29,19.32 28.97,19.35 28.97,20.3 C16.2 29.1,20.3 29.48,20.68 29.48,21.19 29.23,21.44 29.23,21.7
  Top 0.127: 24.02,27.03 24.02,27.41 R1_USB.1 | 24.02,27.03 24.4,26.65 C43.2 24.53,26.52 24.53,25.89 | 24.53,25.89 24.53,25.38 C2.2 | C18.1 19.7,19.92 19.7,20.55 C17.1 19.83,20.68 19.32,21.19 19.32,21.7 C5.2 | 21.86,26.65 21.86,26.39 C8.2 21.86,26.27 21.86,26.01 21.36,25.51 21.36,24.11 C14.2 21.23,23.98 20.72,23.47 20.21,23.47 19.32,22.59 19.32,21.82 C5.2 | 21.86,26.65 21.48,27.03 R2_USB.2 21.1,27.03 C42.2 20.85,27.03 20.09,27.79 20.09,28.55 J4.A12_B1 19.96,28.68 19.32,28.68 18.94,29.06 J4.SH4 | 24.02,27.03 22.24,27.03 21.86,26.65 | IC2.B1 42.82,19.92 41.82,20.91 41.82,24.15 42.35,24.68 42.35,26.99 39.01,30.33 35.45,30.33 34.56,29.44 34.18,29.44 J2.5 | J2.3 34.18,28.17 34.18,29.32 J2.5 | 41.8,17.89 41.42,17.89 41.29,18.01 40.91,18.01 U3.6 40.79,18.14 40.15,18.14 40.02,18.27 U3.9 | 38.5,17.25 38.63,17.25 38.88,17.5 U3.4 39.01,17.63 39.26,17.63 39.9,18.27 U3.9 | 38.5,17.25 38.12,17.25 C27.1 | 38.5,17.25 38.5,15.98 TP_BAT_GND.TP | C22.2 39.77,27.28 39.14,27.28 C4.2 39.01,27.16 38.88,27.16 38.63,26.9 38.63,22.33 C3.2 38.63,22.2 38.63,19.41 38.88,19.16 U3.1 39.01,19.03 39.39,19.03 39.52,18.9 39.52,18.78 39.9,18.39 U3.9 | C37.1 8.15,27.03 8.15,25.12 8.53,24.74 J1.MP1 8.65,24.62 8.65,11.66 J1.MP2 8.81,11.39 9.12,11.39 9.47,11.03 v9.78,11.03 | 21.99,21.44 22.12,21.57 22.12,22.33 U1.P$B7 | U1.P$F23 26.43,21.19 25.67,21.19 25.55,21.32 U1.P$74 21.99,21.44 | 15.26,12.93 15.64,12.55 15.64,12.3 15.26,11.92 14.62,11.92 EPD_C10.1 | 15.26,12.93 15.13,13.06 14.5,13.06 EPD_C9.1 | EPD_C5.1 13.48,18.01 13.73,17.76 13.86,17.76 14.62,17 EPD_C6.1 14.5,16.87 14.5,15.73 EPD_C7.1 14.5,15.6 14.5,15.22
  Top 0.127: 14.5,15.22 14.5,14.46 EPD_C8.1 | 14.5,15.22 16.39,15.22 | 15.26,12.93 16.39,14.07 v16.39,14.83 16.39,15.22 | SW_DN.1 35.45,4.04 35.45,4.81 C29.1 35.58,4.93 36.59,4.93 | D4.1 40.02,5.31 R_TYPE_SEL.1 38.63,5.31 38.25,4.93 36.59,4.93 | 36.59,4.93 36.59,8.11 SJ1.1 36.47,8.23 35.46,8.23 34.56,9.13 34.56,10.9 v35.33,11.66 | SW_ENT.1 24.4,4.04 24.4,4.93 C31.1 24.28,5.06 v23.51,5.82 | SW_UP.1 13.48,4.04 13.48,4.81 C30.1 13.48,4.83 v13.48,7.09 | IC2.B3 43.96,19.92 44.47,19.92 45.1,19.29 | R2_EP_DR.1 40.91,15.22 40.52,15.22 39.64,14.34 38.04,14.34 v37.78,14.08 | C12.2 28.09,16.62 27.64,16.62 v27.32,16.3 | J1.17 11.2,15.85 10.81,15.85 10.65,15.69 v10.65,11.81 | J4.A1_B12 26.56,28.68 27.2,28.68 27.58,29.06 J4.SH3 | D3.2 17.04,33 18.56,33 18.82,33.25 J4.SH2 | 21.99,21.44 U1.P$75 | C34.1 41.8,17.39 41.8,17.89 | J2.5 34.06,29.44 34.06,29.95 33.42,30.59 33.42,30.97 31.13,33.25 27.7,33.25 J4.SH1 | v13.61,8.23 13.48,8.36 | C20.2 19.49,15.22 18.78,15.22 18.26,15.74 17.92,15.74 17.4,15.22 16.39,15.22 | 14.62,21.82 18.24,21.82 18.41,21.99 19.09,21.99 C5.2 | C32.1 45.36,19.03 45.1,19.29 | v44.93,18.55 45.1,18.71 45.1,19.29 | v24.59,14.05 24.59,14.2 C21.2 23.39,15.35 23.39,14.49 22.6,13.7 21.82,13.7 20.09,11.97 20.09,10.52 | 41.8,17.89 41.8,18.19 v41.72,18.28 | v4.72,6.46 4.85,6.33 4.85,4.01 5.7,3.15 5.73,3.15 | C7.2 24.65,15.66 v24.61,15.69
  Route2 0.127: v24.61,15.69 24.59,15.67 v24.59,14.05
  Bottom 0.127: 35.58,16.99 31.25,21.32 28.61,21.32 27.58,20.29 27.23,20.29 27.22,20.3 25.55,20.3 U1.P$82 | U1.P$90 25.55,17.76 26.94,16.36 27.26,16.36 v27.32,16.3 | 13.48,12.55 10.43,12.55 | 13.48,12.55 15.76,14.83 v16.39,14.83 16.39,14.62 16.91,14.11 18.51,14.11 21.9,17.5 U1.P$87 | 41.8,18.52 37.99,18.52 37.74,18.78 37.36,18.78 35.58,16.99 | 13.48,12.55 13.48,8.23 | 13.48,8.23 v13.48,7.09 13.48,6.96 14.62,5.82 v23.51,5.82 | 37.86,14.2 v35.33,11.66 | 13.48,8.23 v13.61,8.23 | 10.43,12.55 10.65,12.34 v10.65,11.81 | v44.93,18.55 44.9,18.52 41.8,18.52 | v41.72,18.28 41.8,18.36 41.8,18.52 | 37.86,14.2 37.86,14.16 v37.78,14.08 | 35.58,16.99 35.58,16.49 37.86,14.2 | v4.72,6.46 v3.32,7.85 | 10.43,12.55 9.78,11.89 v9.78,11.03
  pour Route15: -3.33,-4.87 51.41,-4.87 50.53,-3.99 50.51,-3.97 50.51,37.52 49.56,38.47 -2.88,38.47 -3.33,38.02
HAPTIC_EN  (via drill 0.15, 0.35)
  Top 0.152: IC2.A1 42.59,20.77 v42.59,22.55
  Route2 0.127: 28.07,20.07 28.09,20.05 26.09,20.05 26.09,18.74 25.75,18.4 21.44,18.4 21.09,18.05 20.74,18.05 U1.P$U1
  Route2 0.152: v42.59,22.55 35.59,22.55 32.67,19.63 32.67,19.31 32.33,18.97 31.1,18.97 29.77,20.3 29.31,20.3 29.07,20.05 28.09,20.05
  other vias: 20.45,18.34
IMU_INT1  (via drill 0.3)
  Top 0.127: U1.P$N1 20.47,19.28 20.09,18.9 20.09,18.52 19.83,18.27 18.99,18.27 v18.58,17.85 | IC3.5 3.96,7.47 4.46,7.47 7.96,10.97 v8.94,10.97
  Bottom 0.127: v8.94,10.97 8.94,11.52 15.27,17.85 v18.58,17.85
IMU_INT2  (via drill 0.15, 0.35)
  Top 0.127: IC3.6 4.06,8.06 4.11,8.06 4.59,8.54 v4.59,9.05
  Route2 0.127: v4.59,9.05 v16.09,9.05 | v17.09,11.55 17.09,14.39 v17.25,14.55 | v18.59,16.63 18.59,17.09 19.12,17.63 19.12,17.68 20.54,19.09 U1.P$P2
  Bottom 0.127: v16.09,9.05 17.09,10.05 v17.09,11.55 | v18.59,16.63 18.59,15.23 17.91,14.55 v17.25,14.55
  other vias: 20.95,19.09
LX1
  Top 0.127: IC9.B2 6.12,3.28 6.5,3.28 IC9.B3 6.88,3.38 6.88,5.31 5.99,6.2 L7.1
LX2  (via drill 0.3)
  Top 0.127: IC9.D2 6.12,2.52 6.5,2.52 IC9.D3 7.02,2.44 7.38,2.81 v7.38,2.89 | v7.38,4.81 7.38,5.69 7.89,6.2 L7.2
  Bottom 0.127: v7.38,4.81 v7.38,2.89
MOSI  (via drill 0.15, 0.35)
  Route2 0.127: U1.P$B13 20.99,25.05 18.09,25.05 18.09,24.55 17.09,23.55 v17.09,22.94
  Route15 0.127: J1.14 11.24,23.4 11.09,23.55 11.09,24.05 11.59,24.55 12.59,24.55 13.59,23.55 16.48,23.55 v17.09,22.94
  other vias: 23.7,22.34 11.24,17.39
N$1  (via drill 0.3)
  Top 0.127: C9.1 29.75,18.85 29.54,19.05 v29.54,19.74 | U1.P$N24 27.24,19.05 27.7,19.05 27.8,19.15 v28.58,19.15
  Bottom 0.127: v29.54,19.74 29.17,19.74 v28.58,19.15
N$2
  Top 0.127: R9.2 11.67,26.61 13.05,25.23 IC1.D1
N$3
  Top 0.127: IC9.D1 5.73,2.52 5.61,2.52 4.59,3.54 4.59,4.55 4.21,4.93 R4.2
N$4  (via drill 0.3)
  Top 0.127: v39.64,21.7 39.14,22.2 C3.1 39.14,22.33 L1.1 | U1.P$H23 26.43,20.68 26.82,20.68 26.84,20.71 v27.41,20.71
  Bottom 0.127: v39.64,21.7 39.64,20.68 39.26,20.3 32.66,20.3 31.39,21.57 27.96,21.57 27.41,21.02 v27.41,20.71
N$5
  Top 0.127: IC9.E1 5.73,2.14 5.48,2.14 4.34,3.28 4.34,4.17 4.21,4.3 R2.2
N$6
  Top 0.127: C4.1 39.14,26.78 39.77,26.78 C22.1 39.9,26.65 39.9,25.76 | 39.9,25.76 ANT1.1 | 39.9,25.76 L1.2
N$7  (via drill 0.15, 0.3)
  Top 0.127: v20.09,26.01 18.69,26.01 X1.1 | C1.1 27.11,25.68 26.73,25.3 v26.15,25.3 | U1.P$B24 26.95,22.56 v27.14,22.75
  Route2 0.127: v27.14,22.75 24.89,22.75 24.59,23.05 24.59,25.05 24.84,25.3 v26.15,25.3
  Bottom 0.127: v20.09,26.01 25.59,26.01 26.15,25.46 v26.15,25.3
N$8  (via drill 0.15, 0.3)
  Top 0.127: v23.51,25.25 24.02,25.25 C2.1 | v19.32,24.11 18.05,24.11 17.29,24.87 X1.3 | U1.P$A23 26.45,22.99 v26.02,23.42
  Bottom 0.127: v19.32,24.11 22.37,24.11 v23.51,25.25 24.19,25.25 v26.02,23.42
N$9  (via drill 0.3)
  Top 0.127: v21.23,23.35 21.23,22.33 U1.P$B3 | v23.39,23.47 23.13,23.47 22.5,24.11 L2.1
  Bottom 0.127: v21.23,23.35 23.26,23.35 v23.39,23.47
N$10  (via drill 0.15, 0.3)
  Top 0.127: 26.94,21.44 26.94,21.82 28.09,22.97 | 26.94,21.44 26.94,21.32 U1.P$E24 | 28.09,22.97 28.47,22.59 | 28.47,22.59 28.72,22.33 28.97,22.33 C10.1 | 28.09,22.97 C15.1 | U1.P$B5 21.61,22.33 21.61,22.59 21.48,22.71 21.48,22.97 22.12,23.6 22.12,24.49 22.37,24.74 25.04,24.74 25.13,24.84 25.96,24.84 26.31,24.49 | 26.31,24.49 L3.2 | 28.47,22.59 28.47,22.78 27.9,23.35 v26.76,23.35 | v27.11,24.65 26.94,24.49 26.31,24.49 | 26.94,21.44 27.14,21.25 28.68,21.25 C16.1
  Bottom 0.127: v27.11,24.65 27.11,23.69 v26.76,23.35
N$11
  Top 0.127: R3.2 2.18,6.71 2.3,6.84 IC3.1
N$12  (via drill 0.3)
  Top 0.127: v26.56,22.08 26.43,21.95 26.43,21.57 U1.P$D23 | C11.1 28.34,18.39 28.34,18.14 28.59,17.89 29.99,17.89 30.25,18.14 30.25,19.03 30.21,19.07 30.21,22.07 30.22,22.08 v30.22,22.38
  Bottom 0.127: v26.56,22.08 27.23,22.08 28.64,23.49 29,23.49 30.12,22.38 v30.22,22.38
N$13
  Top 0.127: L2.2 23.39,24.24 25.29,24.24 25.42,24.36 L3.1
N$14  (via drill 0.15, 0.3)
  Top 0.127: C18.2 19.2,19.79 18.69,19.79 18.09,19.19 | X2.2 17.2,18.3 18.09,19.19 | 18.09,19.19 18.18,19.29 v18.26,19.29
  Top 0.15: U1.P$F2 20.63,21.09 20.57,21.14 20.13,21.14 v20.09,21.19
  Bottom 0.127: v20.09,21.19 18.26,19.36 v18.26,19.29
N$15  (via drill 0.15, 0.35)
  Top 0.127: X2.1 17.29,20.68 19.2,20.68 C17.2 19.2,20.82 v18.75,21.27
  Route2 0.127: U1.P$D2 20.95,22.69 20.09,23.55 18.59,23.55 18.27,23.23 18.27,21.87 18.75,21.39 v18.75,21.27
  other vias: 20.95,21.59
N$16
  Top 0.127: C13.1 27.58,24.11 27.31,23.84 25.01,23.84 24.77,23.59 24.77,23.02 U1.P$A18
N$17
  Top 0.127: U1.P$C1 20.47,21.82 19.83,21.82 C5.1
N$18
  Top 0.127: C2-EP-DR.2 45.1,11.54 42.94,11.54 D5.2 42.82,11.66 40.24,11.66 Q3.3 38.98,11.76 38.83,11.76 38.54,12.05 L5.1
N$20
  Top 0.127: C2-EP-DR.1 45.1,10.27 43.71,8.87 D2.1 43.58,8.87 43.58,5.31 D4.2
N$22
  Top 0.127: R_TYPE_SEL.2 38.63,5.95 38.63,6.71 38.5,6.84 R1_EP_DR.1 38.37,6.96 38.37,7.85 38.12,8.11 SJ1.2
N$23
  Top 0.127: EPD_C1.2 13.35,21.32 12.21,21.32 11.7,21.82 11.32,21.82 J1.5
N$24  (via drill 0.3)
  Top 0.127: v43.45,20.93 43.45,20.55 IC2.A2 | v44.85,20.17 45.36,19.66 C32.2
  Bottom 0.127: v43.45,20.93 44.09,20.93 v44.85,20.17
N$25
  Top 0.127: J1.4 11.32,22.46 13.35,22.46 EPD_C2.2
N$26
  Top 0.127: J1.18 11.32,15.47 11.83,15.47 13.23,16.87 EPD_C6.2
N$27
  Top 0.127: C20.1 19.58,16.49 19.96,16.87 20.41,16.87 20.48,16.8 21.07,16.8 21.11,16.84 U1.P$AC5
N$28
  Top 0.127: J1.19 11.32,14.96 12.72,14.96 13.35,15.6 EPD_C7.2
N$29
  Top 0.127: J1.20 11.32,14.46 13.23,14.46 EPD_C8.2
N$30
  Top 0.127: R2_USB.1 21.48,27.66 21.48,28.55 J4.B5
N$32
  Top 0.127: EPD_C10.2 13.23,11.92 11.83,13.31 11.32,13.31 J1.22
N$34
  Top 0.127: R1_USB.2 24.53,27.54 24.53,28.55 J4.A5
N$35
  Top 0.127: J1.24 11.32,12.3 11.32,11.03 12.97,9.38 EPD_C12.2
OUT+
  Top 0.127: TP_OP.TP 44.72,21.26 IC2.A3
OUT-
  Top 0.127: IC2.C3 43.96,19.41 43.96,17.89 44.72,17.12 TP_ON.TP
P0.13  (via drill 0.15, 0.35)
  Top 0.127: SW_UP.2 10.56,4.04 R5.1 10.56,4.81 10.69,4.93 12.85,4.93 C30.2 12.21,5.55 v11.59,5.55
  Route2 0.127: v11.59,5.55 12.59,6.55 v18.09,6.55 | U1.P$AD8 22.45,15.84 18.59,11.98 v18.59,11.55
  Bottom 0.127: v18.09,6.55 18.09,11.05 v18.59,11.55
  other vias: 22.45,16.34
P0.14  (via drill 0.15, 0.35)
  Top 0.127: SW_ENT.2 21.48,4.04 21.48,4.81 R8.1 21.48,4.93 23.64,4.93 C31.2
  Top 0.152: U1.P$AC9 22.3,16.84 22.18,16.96 v22.09,16.96 | v22.09,9.05 v22.09,12.04 | v18.09,4.05 21.51,4.05 SW_ENT.2
  Route2 0.152: v22.09,16.96 22.88,16.17 22.88,12.04 v22.09,12.04 | v22.09,9.05 22.09,8.05 v18.09,4.05
P1.01
  Top 0.127: U1.P$Y23 26.43,17.5 26.43,16.87 26.82,16.49 26.82,15.85 R_PWR_EPD.1 26.82,15.73 27.2,15.35 27.45,15.35 DMG2305UX-7.1
P1.02  (via drill 0.3)
  Top 0.127: SW_DN.2 32.53,4.04 32.53,4.81 R7.1 32.53,4.93 33.42,4.93 34.18,5.69 | v27.7,17.89 26.94,17.89 U1.P$W24 | 34.18,5.69 v34.18,11.41 | 34.18,5.69 34.94,4.93 C29.2
  Bottom 0.127: v34.18,11.41 v27.7,17.89
PMIC_INT  (via drill 0.15, 0.35)
  Route2 0.127: v28.82,23.05 27.65,24.22 27.65,24.88 27.33,25.2 27.02,25.2 25.42,26.79 14.47,26.79 IC1.A1
  Bottom 0.127: U1.P$T2 21.3,18.95 21.3,19.24 21.59,19.52 21.59,19.66 21.3,19.94 21.3,20.44 21.66,20.8 24.55,20.8 24.75,21 25.04,21 25.25,20.8 26.34,20.8 28.59,23.05 v28.82,23.05
  other vias: 20.95,18.59 14.11,26.43
PREVGH  (via drill 0.3)
  Top 0.127: J1.21 11.32,13.82 12.59,13.82 13.23,13.19 EPD_C9.2 13.35,13.06 13.99,12.43 v15.13,12.43 | v42.82,13.7 42.82,14.96 D5.1
  Bottom 0.127: v15.13,12.43 15.57,11.99 18.77,11.99 20.63,10.14 39.09,10.14 42.64,13.7 v42.82,13.7
PREVGL  (via drill 0.3)
  Top 0.127: EPD_C11.2 13.35,10.65 v11.96,12.04 11.83,12.17 11.83,12.68 11.7,12.81 11.32,12.81 J1.23 | D2.2 40.02,8.87 40.02,8.61 39.7,8.29 v39.7,7.92
  Bottom 0.127: v11.96,12.04 11.47,12.04 10.04,10.61 9.43,10.61 8.65,9.84 8.65,9.63 13.23,5.06 36.43,5.06 39.29,7.92 v39.7,7.92
RESE  (via drill 0.3)
  Top 0.127: v39.01,12.18 39.01,13.07 Q3.2 | v34.56,23.86 37.61,20.81 v37.61,18.27 | J1.3 11.2,22.97 10.81,22.97 10.6,23.18 10.6,25.97 v10.43,26.14 | v24.79,29.66 22.88,31.57 v22.88,31.98 | R1_EP_DR.2 39.01,11.07 v38.86,11.22
  Bottom 0.127: v34.56,23.86 34.56,26.9 33.55,27.92 33.29,27.92 32.66,27.29 27.2,27.29 26.73,27.75 26.7,27.75 v24.79,29.66 | v37.61,18.27 39.9,18.27 40.91,17.25 40.91,14.08 v39.01,12.18 39.01,11.75 38.86,11.61 v38.86,11.22 | v10.43,26.14 10.6,26.31 10.6,29.83 12.75,31.98 v22.88,31.98
RESET  (via drill 0.15, 0.35)
  Top 0.127: TP_RESET.TP 39.77,31.98 37.23,34.52 27.32,34.52 26.69,33.89 26.69,32.74 27.32,32.11 29.86,32.11 32.53,29.44 32.78,29.44 J2.6 32.43,29.88 32.19,29.88 31.09,30.98 v31.09,32.05
  Route2 0.127: v32.09,19.55 32.09,21.55 29.59,21.55 29.59,24.9 29.51,24.98 29.51,30.47 v31.09,32.05 | U1.P$AC13 30.38,16.84 v30.59,17.05
  Bottom 0.127: v32.09,19.55 31.59,19.05 30.59,19.05 v30.59,17.05
  other vias: 23.7,16.84
SCK  (via drill 0.3)
  Top 0.127: v21.99,22.84 22.37,23.22 23.01,23.22 23.39,22.84 U1.P$A12 | J1.13 11.51,17.89 11.78,17.62 11.78,17.59 v12.07,17.3
  Bottom 0.127: v21.99,22.84 20.09,22.84 19.96,22.97 18.73,22.97 14.66,18.9 14.66,18.71 13.25,17.3 v12.07,17.3
SCL  (via drill 0.15, 0.3)
  Top 0.127: R2.1 3.7,4.42 3.7,4.81 R4.1 3.58,4.93 3.32,5.18 v3.32,5.44 | v1.8,7.34 2.3,7.34 IC3.12 | IC2.C1 42.82,19.41 42.45,19.41 v42.43,19.43 | U3.7 40.91,18.65 41.18,18.65 41.46,18.93 41.46,19.32 41.15,19.62 v41.15,19.79 | v13.35,27.03 13.35,26.65 13.99,26.01 14.12,26.01 IC1.B1 14.07,26.03 | v9.16,9.76 8.4,9 8.15,9 TP_SCL.TP 7.03,8.91 v6.62,8.51 | v43.58,16.23 43.58,13.31 v43.95,12.94 | R17.2 15.81,27.58 v15.81,27.33
  Route2 0.127: 11.59,21.55 11.59,27.05 13.33,27.05 v13.35,27.03
  Route2 0.152: U1.P$M2 20.79,19.43 19.59,19.43 19.59,19.55 19.09,20.05 18,20.05 17.49,19.54 13.6,19.54 11.59,21.55
  Bottom 0.127: 42.31,21.44 42.31,21.57 36.59,27.28 34.69,27.28 30.5,31.47 12.6,31.47 10.94,29.81 10.94,29.44 v13.35,27.03 13.57,27.25 14.21,27.25 14.29,27.33 v15.81,27.33 | 42.28,19.41 42.28,21.44 42.31,21.44 | v9.16,9.76 10.05,9.76 14.5,5.31 36.33,5.31 v43.95,12.94 | 42.31,21.44 45.22,21.44 45.36,21.3 45.36,18.39 43.58,16.61 v43.58,16.23 | v6.62,8.51 6.52,8.61 4.41,8.61 4.15,8.87 4.15,8.89 3.62,9.41 2.26,9.41 1.8,8.95 v1.8,7.34 1.8,6.97 v3.32,5.44 | 42.28,19.41 42.3,19.43 v42.43,19.43 | v41.15,19.79 41.54,19.41 42.28,19.41
  other vias: 20.95,19.59
SDA  (via drill 0.15, 0.3, 0.35)
  Top 0.127: 12.98,26.64 12.46,27.16 12.46,31.79 11.44,32.82 8.86,32.82 6.12,30.08 | 12.98,26.64 13.23,26.39 13.23,25.55 13.95,25.55 14.02,25.63 IC1.C1 | 6.12,30.08 4.97,28.93 R18.2 4.85,28.81 4.46,29.19 3.19,29.19 TP_SDA.TP | IC3.2 2.94,6.84 2.94,6.25 3.27,5.91 3.62,5.91 4.3,6.59 4.3,6.67 5.23,7.6 8.53,7.6 10.19,9.26 10.19,11.2 9.58,11.81 9.58,19.51 9.33,19.76 9.33,20.34 | v39.14,20.81 40.79,19.16 U3.8 | 12.98,26.64 v12.6,26.27 | 6.12,30.08 9.33,26.87 9.33,20.34 | 9.33,20.34
  Top 0.152: 43.41,19.99 IC2.B2 | U3.8 40.89,19.27 40.6,19.56 40.6,20.87 v40.41,21.05
  Route2 0.127: U1.P$L1 19.8,19.84 19.09,20.55 15.02,20.55 v14.59,20.12
  Route2 0.152: IC2.B2 42.69,19.95 41.59,21.05 v40.41,21.05
  Bottom 0.127: v39.14,20.81 32.53,20.81 26.64,26.7 24.82,26.7 24.75,26.77 13.73,26.77 13.23,26.27 v12.6,26.27 13.47,26.27 13.97,26.77 15.84,26.77 17.53,25.08 17.53,22.75 17.27,22.5 16.97,22.5 v14.59,20.12
  other vias: 20.45,19.84 43.41,19.95
SWDCLK
  Top 0.127: 31.64,21.82 31.64,24.11 32.53,25 32.53,26.39 32.28,26.65 32.28,27.54 32.78,28.05 J2.4 | 31.64,21.82 31.64,21.19 31.01,20.55 31.01,18.52 30.12,17.63 28.09,17.63 27.83,17.38 26.94,17.38 U1.P$AA24 | 31.64,21.82 32.74,21.82 35.23,19.33 TP_SWDCLK.TP
SWDIO  (via drill 0.3)
  Top 0.127: U1.P$AC24 26.94,16.87 27.7,16.87 28.21,17.38 30.29,17.38 30.41,17.49 31.63,17.49 32.02,17.89 TP_SWDIO.TP 32.15,18.01 32.66,18.52 v32.66,21.32 | v33.42,27.41 32.91,26.9 J2.2
  Bottom 0.127: v33.42,27.41 33.42,26.65 32.66,25.89 v32.66,21.32
SWO  (via drill 0.15, 0.35)
  Top 0.152: TP_SWO.TP 28.92,13.55 28.75,13.55 v28.59,13.39
  Route2 0.152: U1.P$AD22 28.09,14.2 28.09,13.89 v28.59,13.39
  other vias: 25.95,16.34
VBAT  (via drill 0.15, 0.3)
  Top 0.3: v8.91,26.65 8.53,27.03 C37.2 | IC1.C2 14.5,25.63 15.13,25.63 v15.5,25.26 16.47,26.22 16.47,26.56 16.66,26.75 v16.66,27.59 | 38.53,18.51 U3.3 39.01,18.14 39.01,18.52 U3.2 | 38.5,18.51 38.53,18.51 | v32.15,22.33 34.31,22.33 35.71,20.93 TP_VBAT.TP 35.83,20.81 35.83,18.91 36.98,17.76 38.03,17.76 C27.2 38.53,18.26 38.53,18.51
  Bottom 0.3: v15.5,25.26 10.3,25.26 v8.91,26.65 | v32.15,22.33 31.67,22.33 26.96,27.04 24.96,27.04 24.89,27.11 17.14,27.11 v16.66,27.59
VBUS  (via drill 0.15, 0.3, 0.35)
  Top 0.3: v13.85,27.66 14.43,27.09 14.43,26.51 IC1.A2 | C38.2 11.32,32.36 11.45,32.24 v11.45,29.73 | C42.1 20.97,27.66 20.97,28.55 J4.A9_B4 21.08,28.83 21.08,29.29 21.1,29.31 21.1,30.04 20.54,30.61 17.14,30.61 16.66,31.09 | D3.5 14.5,32.87 14.84,32.87 16.11,31.61 16.11,31.52 16.27,31.36 16.39,31.36 16.66,31.09 | 16.66,31.09 v16.66,30.97 | C21.1 22.23,14.46 v22.32,14.37 21.47,14.37 20.15,13.05 v18.09,13.05 | v30.63,20.81 30.63,21.89 31.14,22.4 31.14,23 27.48,26.65 25.8,26.65 C43.1 25.61,26.87 v25.17,27.54 25.17,27.65 25.44,27.91 25.44,28.38 J4.A4_B9 | U1.P$AD2 20.9,16.29 20.5,16.29 v20.27,16.53
  Route2 0.3: v18.09,13.05 18.09,13.55 20.14,15.6 20.14,16 20.27,16.13 v20.27,16.53
  Bottom 0.3: v22.32,14.37 22.54,14.58 26.68,14.58 27.83,15.73 27.83,16.62 27.2,17.26 27.2,18.66 29.35,20.81 v30.63,20.81 | v25.17,27.54 24.27,27.54 20.85,30.97 v16.66,30.97 16.66,30.47 v13.85,27.66 11.95,29.57 11.61,29.57 v11.45,29.73
VREG  (via drill 0.15, 0.3)
  Top 0.3: C24.2 3.7,3.28 2.94,3.28 TP_VREG.TP 2.18,4.17 v2.18,5.44 | C39.1 13.12,28.3 14.34,28.3 14.59,28.05 14.59,27.55 15.59,26.55 15.59,26.19 v15.56,26.16 14.65,26.16 IC1.B2 | 6.12,3.66 5.99,3.66 | 5.99,3.66 5.73,3.66 IC9.A1 | 6.12,3.66 6.5,3.66 IC9.A3 | 6.12,3.66 IC9.A2 | 5.99,3.66 v5.99,4.67 | C23.2 8.28,3.59 v8.73,4.04
  Bottom 0.3: 2.3,5.57 3.2,4.67 v5.99,4.67 5.99,2.19 7.43,0.75 7.85,0.75 8.78,1.68 8.78,3.15 8.73,3.21 v8.73,4.04 | 2.3,5.57 1.29,6.58 1.29,9.37 1.68,9.76 6.76,9.76 7.88,10.88 7.88,19.61 11.93,23.65 14.53,23.65 16.01,25.13 16.01,25.73 15.58,26.16 v15.56,26.16 | 2.3,5.57 v2.18,5.44
(copper drawn outside any net)
  shapes: Route15 area x1